# Altium schematic sheet Sheet4.SchDoc
size 420 x 297 mm
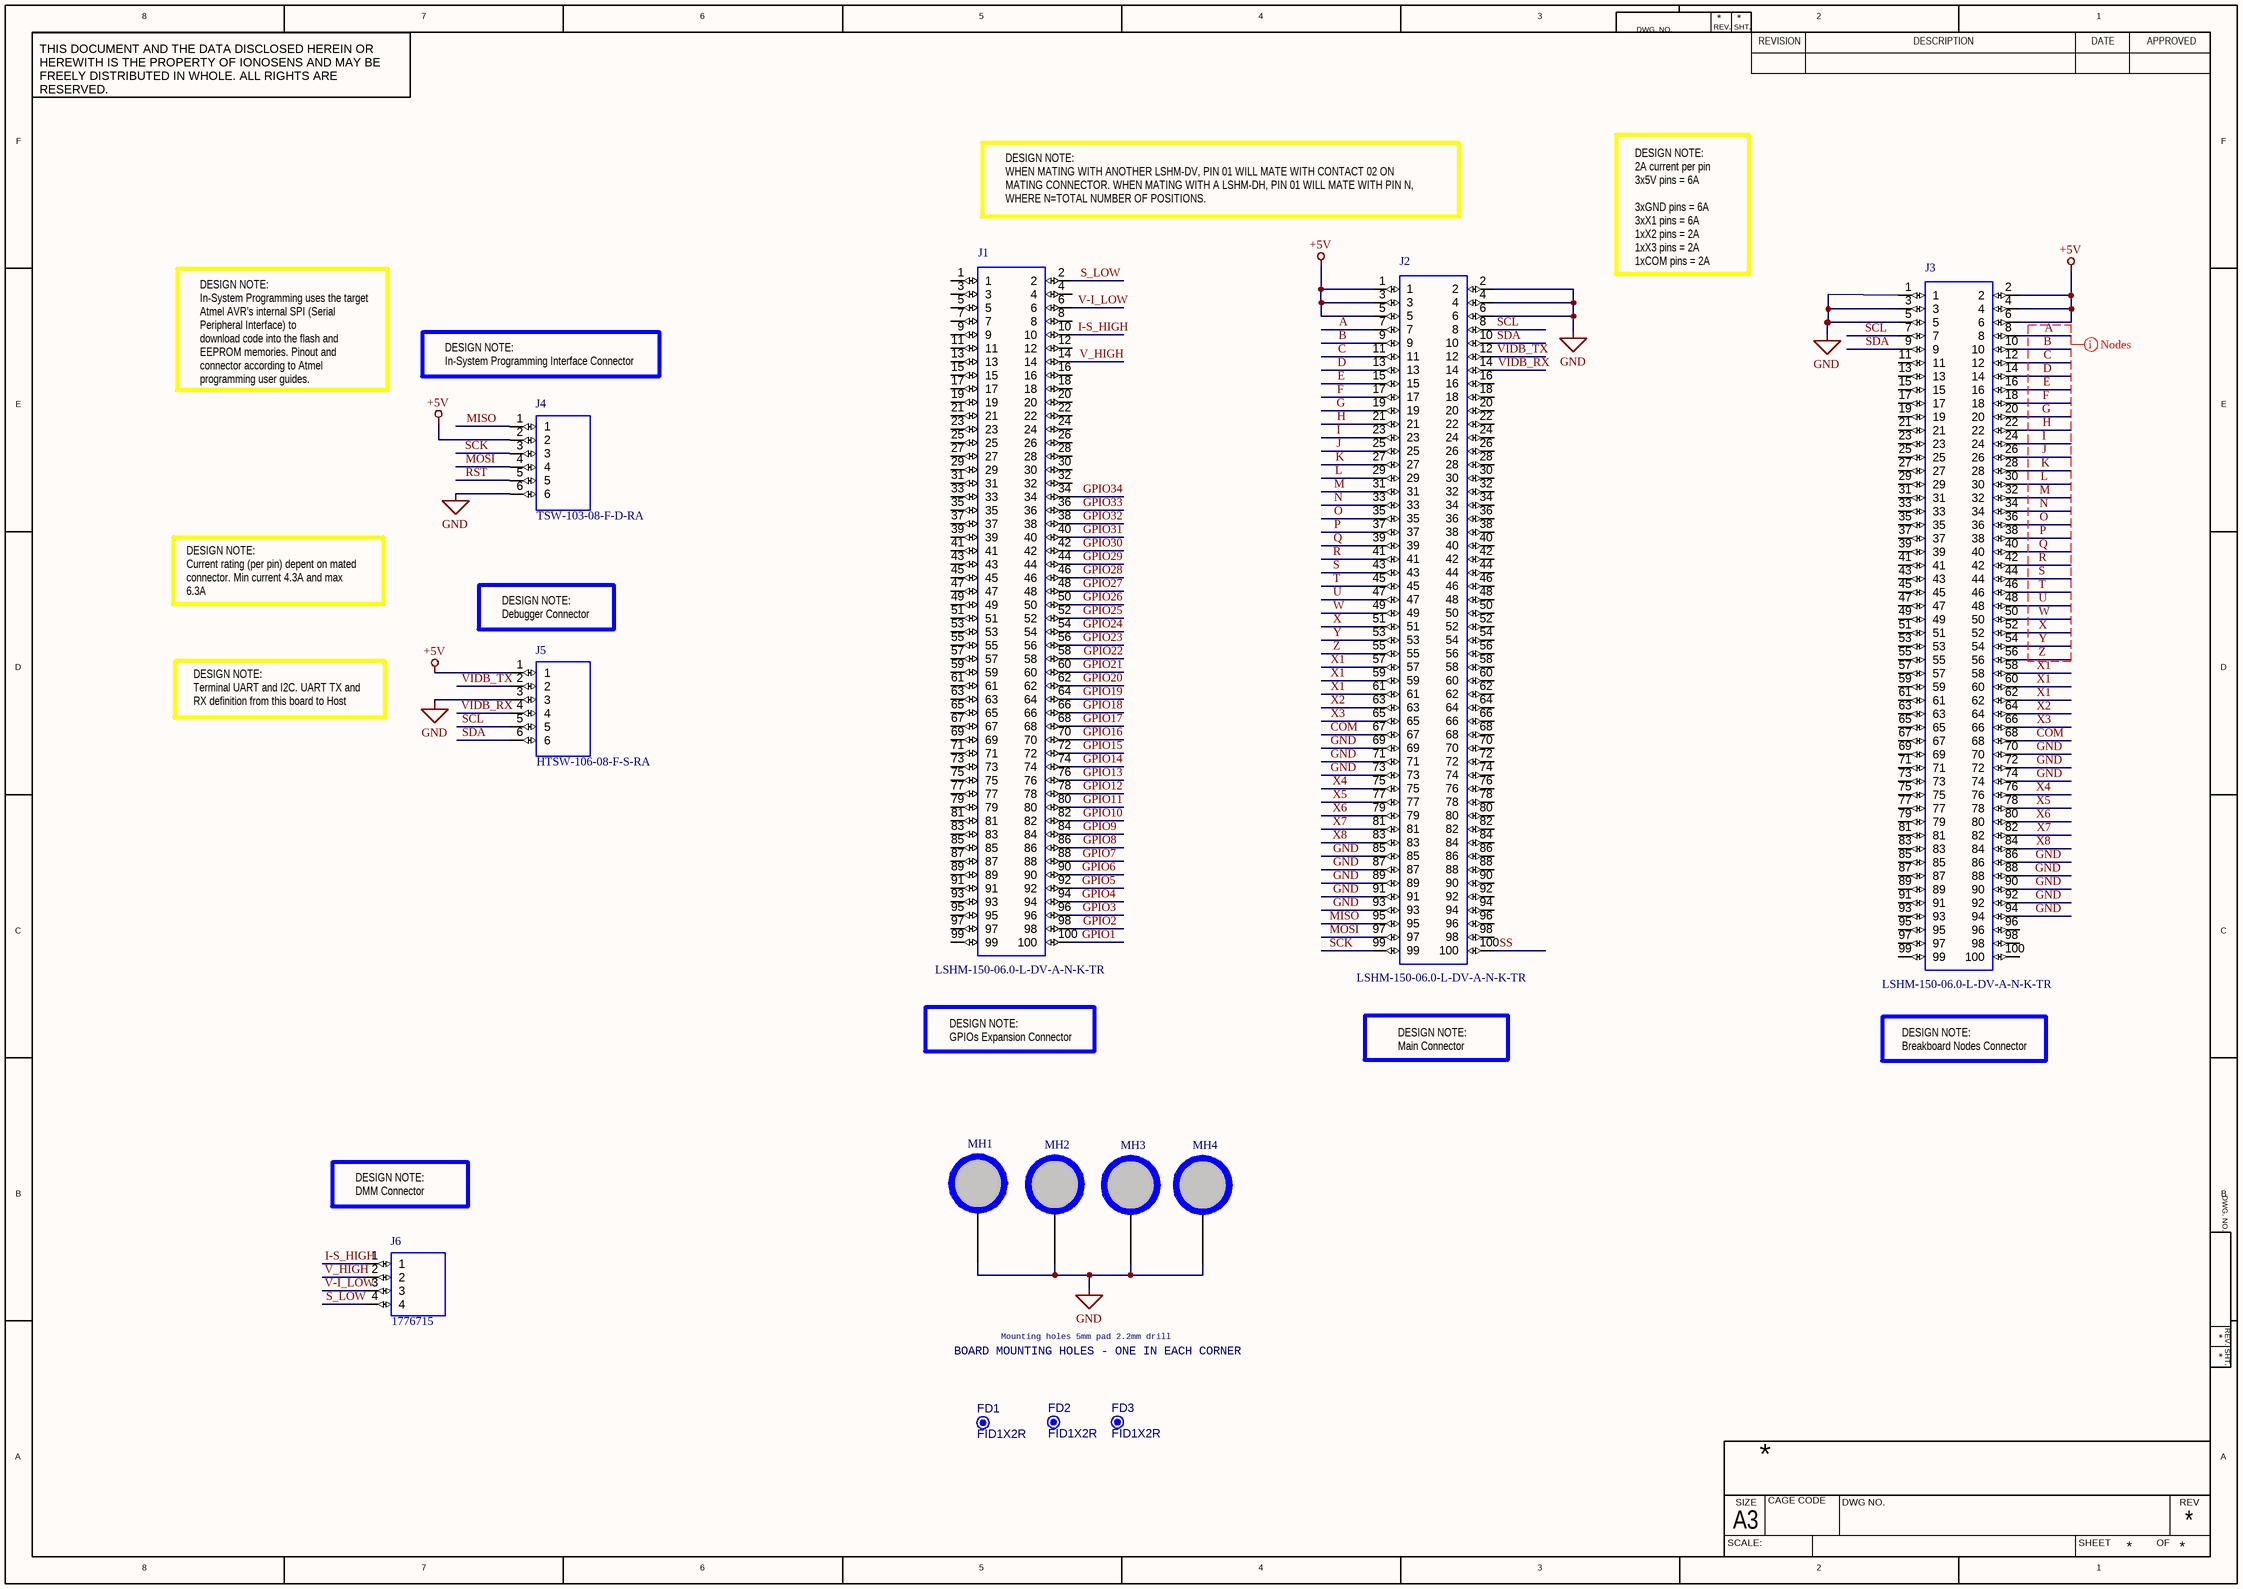
[diagram p0: Sheet4.SchDoc]

## Parts
FD1  FID1X2R  [FID1X2R]  (no BOM)
FD2  FID1X2R  [FID1X2R]  (no BOM)
FD3  FID1X2R  [FID1X2R]  (no BOM)
J1  LSHM-150-06.0-L-DV-A-N-K-TR  [LSHM_150_06_0_L_DV_A_N_K_TR]
J2  LSHM-150-06.0-L-DV-A-N-K-TR  [LSHM_150_06_0_L_DV_A_N_K_TR]
J3  LSHM-150-06.0-L-DV-A-N-K-TR  [LSHM_150_06_0_L_DV_A_N_K_TR]
J4  TSW-103-08-F-D-RA  [TSW-103-08-F-D-RA]
J5  HTSW-106-08-F-S-RA  [TSW-106-08-F-S-RA]
J6  1776715  [1776715]
MH1  C500h220  [C500h220z368]  (value not drawn)
MH2  C500h220  [C500h220z368]  (value not drawn)
MH3  C500h220  [C500h220z368]  (value not drawn)
MH4  C500h220  [C500h220z368]  (value not drawn)

## Nets
+5V: J2.1 J2.3 J2.5 J3.2 J3.4 J3.6 J4.2 J5.1
GND: J2.2 J2.4 J2.6 J2.69 J2.71 J2.73 J2.85 J2.87 J2.89 J2.91 J2.93 J3.1 J3.3 J3.5 J3.70 J3.72 J3.74 J3.86 J3.88 J3.90 J3.92 J3.94 J4.6 J5.3 MH1.1 MH2.1 MH3.1 MH4.1
A: J2.7 J3.8
B: J2.9 J3.10
C: J2.11 J3.12
COM: J2.67 J3.68
D: J2.13 J3.14
E: J2.15 J3.16
F: J2.17 J3.18
G: J2.19 J3.20
GPIO1: J1.100
GPIO2: J1.98
GPIO3: J1.96
GPIO4: J1.94
GPIO5: J1.92
GPIO6: J1.90
GPIO7: J1.88
GPIO8: J1.86
GPIO9: J1.84
GPIO10: J1.82
GPIO11: J1.80
GPIO12: J1.78
GPIO13: J1.76
GPIO14: J1.74
GPIO15: J1.72
GPIO16: J1.70
GPIO17: J1.68
GPIO18: J1.66
GPIO19: J1.64
GPIO20: J1.62
GPIO21: J1.60
GPIO22: J1.58
GPIO23: J1.56
GPIO24: J1.54
GPIO25: J1.52
GPIO26: J1.50
GPIO27: J1.48
GPIO28: J1.46
GPIO29: J1.44
GPIO30: J1.42
GPIO31: J1.40
GPIO32: J1.38
GPIO33: J1.36
GPIO34: J1.34
H: J2.21 J3.22
I: J2.23 J3.24
I-S_HIGH: J1.10 J6.1
J: J2.25 J3.26
K: J2.27 J3.28
L: J2.29 J3.30
M: J2.31 J3.32
MISO: J2.95 J4.1
MOSI: J2.97 J4.4
N: J2.33 J3.34
O: J2.35 J3.36
P: J2.37 J3.38
Q: J2.39 J3.40
R: J2.41 J3.42
RST: J4.5
S: J2.43 J3.44
S_LOW: J1.2 J6.4
SCK: J2.99 J4.3
SCL: J2.8 J3.7 J5.5
SDA: J2.10 J3.9 J5.6
SS: J2.100
T: J2.45 J3.46
U: J2.47 J3.48
V-I_LOW: J1.6 J6.3
V_HIGH: J1.14 J6.2
VIDB_RX: J2.14 J5.4
VIDB_TX: J2.12 J5.2
W: J2.49 J3.50
X: J2.51 J3.52
X1: J2.57 J2.59 J2.61 J3.58 J3.60 J3.62
X2: J2.63 J3.64
X3: J2.65 J3.66
X4: J2.75 J3.76
X5: J2.77 J3.78
X6: J2.79 J3.80
X7: J2.81 J3.82
X8: J2.83 J3.84
Y: J2.53 J3.54
Z: J2.55 J3.56

Not connected (* = marked no-connect by the designer): J1 1 3 4 5 7 8 9 11 12 13 15 16 17 18 19 20 21 22 23 24 25 26 27 28 29 30 31 32 33 35 37 39 41 43 45 47 49 51 53 55 57 59 61 63 65 67 69 71 73 75 77 79 81 83 85 87 89 91 93 95 97 99; J2 16 18 20 22 24 26 28 30 32 34 36 38 40 42 44 46 48 50 52 54 56 58 60 62 64 66 68 70 72 74 76 78 80 82 84 86 88 90 92 94 96 98; J3 11 13 15 17 19 21 23 25 27 29 31 33 35 37 39 41 43 45 47 49 51 53 55 57 59 61 63 65 67 69 71 73 75 77 79 81 83 85 87 89 91 93 95 96 97 98 99 100

## Layout directives
net class Nodes: A, B, C, D, E, F, G, H, I, J, K, L, M, N, O, P, Q, R, S, T, U, W, X, Y, Z

## Notes on the sheet
- DESIGN NOTE:
  WHEN MATING WITH ANOTHER LSHM-DV, PIN 01 WILL MATE WITH CONTACT 02 ON
  MATING CONNECTOR. WHEN MATING WITH A LSHM-DH, PIN 01 WILL MATE WITH PIN N,
  WHERE N=TOTAL NUMBER OF POSITIONS.
- DESIGN NOTE:
  2A current per pin
  3x5V pins = 6A
  3xGND pins = 6A
  3xX1 pins = 6A
  1xX2 pins = 2A
  1xX3 pins = 2A
  1xCOM pins = 2A
- DESIGN NOTE:
  In-System Programming uses the target Atmel AVR’s internal SPI (Serial Peripheral Interface) to
  download code into the flash and EEPROM memories. Pinout and connector according to Atmel programming user guides.
- DESIGN NOTE:
  In-System Programming Interface Connector
- DESIGN NOTE:
  Current rating (per pin) depent on mated connector. Min current 4.3A and max 6.3A
- (near J5) DESIGN NOTE:
  Debugger Connector
- DESIGN NOTE:
  Terminal UART and I2C. UART TX and RX definition from this board to Host
- DESIGN NOTE:
  GPIOs Expansion Connector
- DESIGN NOTE:
  Main Connector
- DESIGN NOTE:
  Breakboard Nodes Connector
- DESIGN NOTE:
  DMM Connector
- Mounting holes 5mm pad 2.2mm drill
- BOARD MOUNTING HOLES - ONE IN EACH CORNER
- 8
- 7
- 6
- 5
- 4
- 3
- DWG. NO.
- REV.
- SHT.
- REVISION
- 2
- DESCRIPTION
- DATE
- 1
- APPROVED
- THIS DOCUMENT AND THE DATA DISCLOSED HEREIN OR HEREWITH IS THE PROPERTY OF IONOSENS AND MAY BE FREELY DISTRIBUTED IN WHOLE. ALL RIGHTS ARE RESERVED.
- F
- E
- D
- C
- B
- A
- SCALE:
- A3
- SIZE
- CAGE CODE
- DWG NO.
- SHEET
- OF
- REV

## Library data of the parts
FD1-FD3 = CMP-00028-00005-2: Fiducial - Round 1x2mm; Pins: 0
J1-J3 = J01-001-01-00001-2: Conn Socket and Terminal Strip HDR/SKT 100 POS 0.5mm Solder ST SMD T/R; Manufacturer: Samtec; Gender: HERMAPHRODITIC; Pitch: 500 µm; Contact Plating: Gold; Case/Package: SMD; Max Operating Temperature: 125°C; Number of Rows: 2; RoHS Compliant: Yes; Housing Color: Black; Mounting Technology: SMD; Pins: 100; Termination: Solder; Orientation: Straight; Depth: 4.98 mm; Length: 29.7 mm; Contact Material: Bronze; Housing Material: Polymer; Min Operating Temperature: -55°C; Manufacturer P/N: LSHM-150-06.0-L-DV-A-N-K-TR
J4 = J01-001-01-00003-2: 6 Vias Pin Header 2.54mm, Right Angle; Manufacturer: Samtec; Gender: Male; Orientation: Straight; Mounting Technology: Through Hole; Contact Material: Bronze; Housing Material: Polyester; Pitch: 2.54mm; Housing Color: Black; Termination: Solder; Min Operating Temperature: -55°C; Pins: 6; Depth: 4.87 mm; RoHS Compliant: Yes; Manufacturer P/N: TSW-103-08-F-D-RA; Length: 7.62 mm; Contact Plating: Gold; Number of Rows: 2; Max Operating Temperature: 125°C; Case/Package: Through Hole
J5 = J01-001-01-00005-2: 6 Vias Pin Header 2.54mm, Right Angle, 1 Row; Manufacturer: Samtec; Gender: Male; Mounting Technology: Through Hole; RoHS Compliant: Yes; Contact Plating: Gold; Max Operating Temperature: 125°C; Pins: 6; Housing Material: Polyester; Case/Package: Through Hole; Pitch: 2.54mm; Contact Material: Bronze; Length: 7.62 mm; Termination: Solder; Number of Rows: 2; Manufacturer P/N: HTSW-106-08-F-S-RA; Depth: 4.87 mm; Orientation: Straight; Min Operating Temperature: -55°C; Housing Color: Black
J6 = J01-001-01-00007-2: Pluggable Terminal Blocks 4 Pos 5mm pitch Thro ugh Hole Header; Manufacturer: Phoenix Contact; Gender: Male; Pitch: 5; Housing Color: Green; Orientation: Right Angle; Housing Material: Polybutylene; Number of Rows: 1; Max Operating Temperature: 125°C; Contact Material: -; Case/Package: TH; Depth: 12; Contact Plating: Tin; RoHS Compliant: Yes; Pins: 4; Termination: Solder; Mounting Technology: TH; Manufacturer P/N: 1776715; Length: 30; Min Operating Temperature: -55°C
MH1-MH4 = CMP-00028-00007-2: hole 5mm pad drill 2.2; Manufacturer: Ionosens; Manufacturer P/N: H5D22; Mounting Technology: Pad; RoHS Compliant: yes; Case/Package: Pad; Min Operating Temperature: 125°C; Pins: 1; Max Operating Temperature: -40°C